# EAGLE design minimal-atmega32u4-arduino (EAGLE 9.5.1)

## Sheet 1 of 2
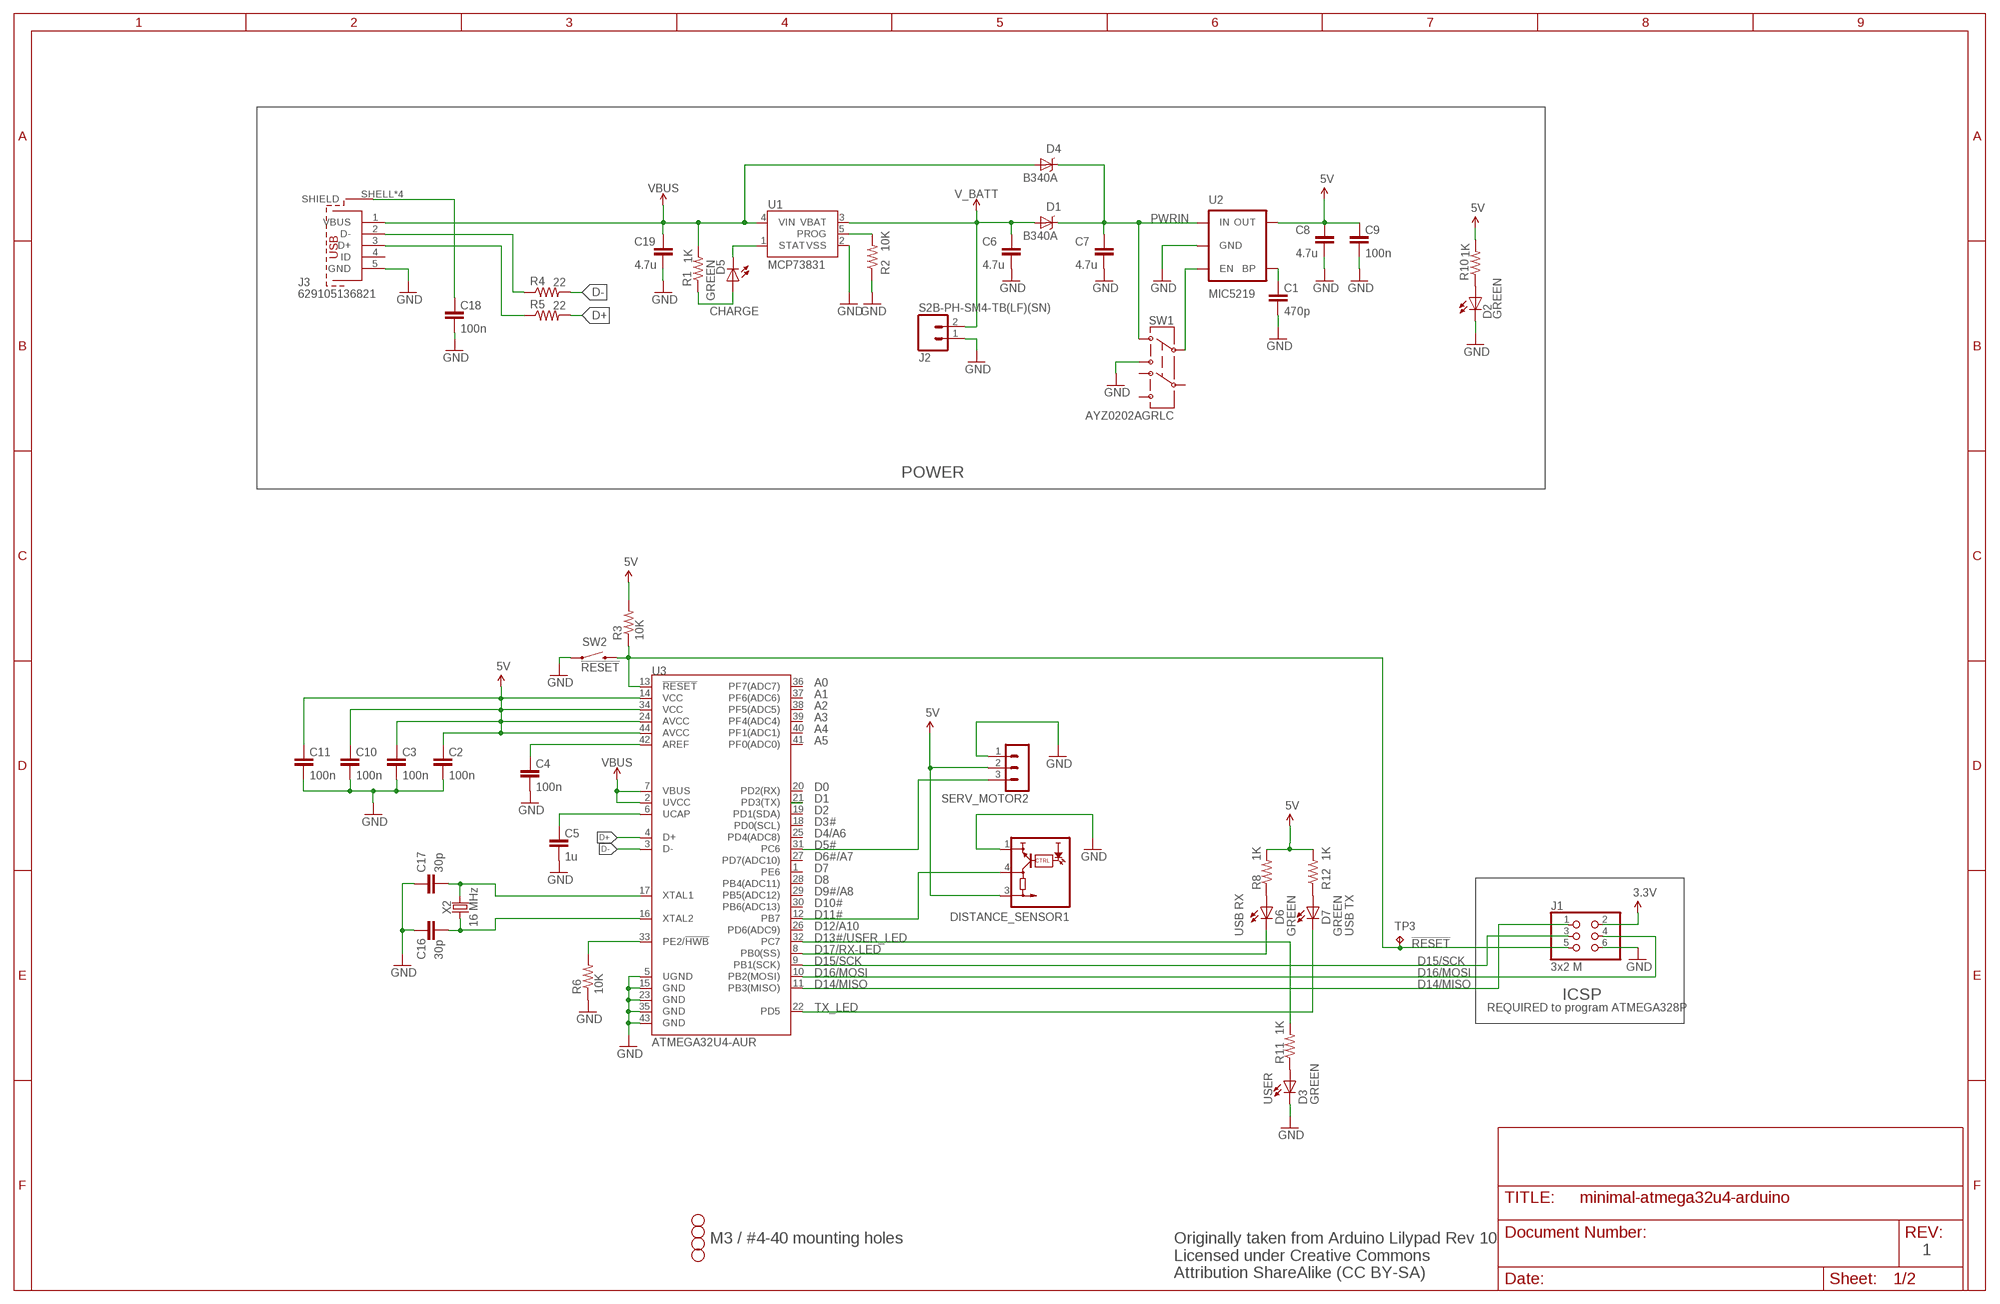
[diagram p0: schematic, sheet 1]

### Parts
C1  470p  C-EUC0805K  [C0805K]
C2  100n  C-EUC0805K  [C0805K]
C3  100n  C-EUC0805K  [C0805K]
C4  100n  C-EUC0805K  [C0805K]
C5  1u  C-EUC0805K  [C0805K]
C6  4.7u  C-EUC0805K  [C0805K]
C7  4.7u  C-EUC0805K  [C0805K]
C8  4.7u  C-EUC0805K  [C0805K]
C9  100n  C-EUC0805K  [C0805K]
C10  100n  C-EUC0805K  [C0805K]
C11  100n  C-EUC0805K  [C0805K]
C16  30p  C-EUC0805K  [C0805K]
C17  30p  C-EUC0805K  [C0805K]
C18  100n  C-EUC0805K  [C0805K]
C19  4.7u  C-EUC0805K  [C0805K]
D1  B340A  DIODE-SCHOTTKY_  [SMA-DIODE]
D2  GREEN  LEDCHIP-LED0805  [CHIP-LED0805]
D3  GREEN  LEDCHIP-LED0805  [CHIP-LED0805]
D4  B340A  DIODE-SCHOTTKY_  [SMA-DIODE]
D5  GREEN  LEDCHIP-LED0805  [CHIP-LED0805]
D6  GREEN  LEDCHIP-LED0805  [CHIP-LED0805]
D7  GREEN  LEDCHIP-LED0805  [CHIP-LED0805]
DISTANCE_SENSOR1  TSSP6P38  [TSSP6P38]
H1  STAND-OFF  [STAND-OFF]
H2  STAND-OFF  [STAND-OFF]
H3  STAND-OFF  [STAND-OFF]
H4  STAND-OFF  [STAND-OFF]
J1  3x2 M  PINHD-2X3  [2X03]
J2  S2B-PH-SM4-TB(LF)(SN)  M02-JST-2MM-SMT  [JST-2-SMD]
J3  629105136821  [629105136821]
R1  1K  R-US_R0805  [R0805]
R2  10K  R-US_R0805  [R0805]
R3  10K  R-US_R0805  [R0805]
R4  22  R-US_R0805  [R0805]
R5  22  R-US_R0805  [R0805]
R6  10K  R-US_R0805  [R0805]
R8  1K  R-US_R0805  [R0805]
R10  1K  R-US_R0805  [R0805]
R11  1K  R-US_R0805  [R0805]
R12  1K  R-US_R0805  [R0805]
SERV_MOTOR2  MA03-1  [MA03-1]
SW1  AYZ0202AGRLC  SWITCH-DPDTSMD  [AYZ0202]
SW2  !RESET  SWITCH-MOMENTARY-2SMD  [TACTILE_SWITCH_SMD]
TP3  TPPAD1-13  [P1-13]
U1  MCP73831  [SOT23-5]
U2  MIC5219  V_REG_MIC5219SMD  [SOT23-5]
U3  ATMEGA32U4-AUR  ATMEGA32U4TQFP-44  [TQFP44]
X2  16 MHz  CRYSTALSMD-HC49UP  [HC49UP]

### Nets
3.3V: C2.1 C3.1 C8.1 C9.1 C10.1 C11.1 J1.2 R3.2 R8.2 R10.2 R12.2 U2.5(OUT) U3.14(VCC) U3.24(AVCC) U3.34(VCC) U3.44(AVCC) ; supply symbol labelled 5V
3.3V3: DISTANCE_SENSOR1.3(VS) SERV_MOTOR2.2 ; supply symbol labelled 5V
!RESET: J1.5 R3.1 SW2.3 TP3.TP U3.13(!RESET)
AREF: C4.1 U3.42(AREF)
D13#/USER_LED: R11.2 U3.32(PC7)
D14/MISO: J1.1 U3.11(PB3(MISO))
D15/SCK: J1.3 U3.9(PB1(SCK))
D16/MOSI: J1.4 U3.10(PB2(MOSI))
D17/RX-LED: D6.C U3.8(PB0(SS))
D+: R5.2 U3.4(D+)
D-: R4.2 U3.3(D-)
GND: C1.2 C2.2 C3.2 C4.2 C5.2 C6.2 C7.2 C8.2 C9.2 C10.2 C11.2 C16.2 C17.2 C18.2 C19.2 D2.C D3.C DISTANCE_SENSOR1.1(GND) J1.6 J2.1 J3.5(GND) R2.1 R6.1 SERV_MOTOR2.1 SW1.3 SW2.1 U1.2(VSS) U2.2(GND) U3.5(UGND) U3.15(GND) U3.23(GND) U3.35(GND) U3.43(GND)
GND1: SERV_MOTOR2.3 U3.31(PC6)
MCPPROG: R2.2 U1.5(PROG)
MIC-BP: C1.1 U2.4(BP)
MIC-EN: SW1.2 U2.3(EN)
N$1: DISTANCE_SENSOR1.4(OUT) U3.12(PB7)
N$3: D5.A R1.1
N$4: D5.C U1.1(STAT)
N$5: U3.21(PD3(TX))
N$7: D2.A R10.1
N$13: D3.A R11.1
N$14: C18.1 J3.SHELL1(SHIELD) J3.SHELL2(SHIELD) J3.SHELL3(SHIELD) J3.SHELL(SHIELD)
N$15: D6.A R8.1
N$16: D7.A R12.1
N$19: J3.2(D-) R4.1
N$20: J3.3(D+) R5.1
PE2/!HWB: R6.2 U3.33(PE2/!HWB)
PWRIN: C7.1 D1.C D4.C SW1.1 U2.1(IN)
TX_LED: D7.C U3.22(PD5)
UCAP: C5.1 U3.6(UCAP)
V_BATT: C6.1 D1.A J2.2 U1.3(VBAT)
VBUS: C19.1 D4.A J3.1(VBUS) R1.2 U1.4(VIN) U3.2(UVCC) U3.7(VBUS)
XTAL1: C17.1 U3.17(XTAL1) X2.2
XTAL2: C16.1 U3.16(XTAL2) X2.1
Unconnected: J3.4(ID) SW1.4 SW1.5 SW1.6 U3.1(PE6) U3.18(PD0(SCL)) U3.19(PD1(SDA)) U3.20(PD2(RX)) U3.25(PD4(ADC8)) U3.26(PD6(ADC9)) U3.27(PD7(ADC10)) U3.28(PB4(ADC11)) U3.29(PB5(ADC12)) U3.30(PB6(ADC13)) U3.36(PF7(ADC7)) U3.37(PF6(ADC6)) U3.38(PF5(ADC5)) U3.39(PF4(ADC4)) U3.40(PF1(ADC1)) U3.41(PF0(ADC0))

### Notes on the sheet
- CHARGE
- POWER
- A0
- A1
- A2
- A3
- A4
- A5
- D0
- D1
- D2
- D3#
- D4/A6
- D5#
- D6#/A7
- D7
- D8
- D9#/A8
- D10#
- D11#
- D12/A10
- USB RX | USB TX
- ICSP
- REQUIRED to program ATMEGA328P
- USER
- M3 / #4-40 mounting holes
- 1
- Originally taken from Arduino Lilypad Rev 10
  Licensed under Creative Commons 
  Attribution ShareAlike (CC BY-SA)

## Sheet 2 of 2

## Library data of the parts
C1 = rcl:C-EU: CAPACITOR, European symbol; DESC: CAP CER 470PF 50V X7R 0805; MFR: Samsung; MPN: CL21B471KBANNNC; SPICEPREFIX: C
C2-C4 C9-C11 C18 = rcl:C-EU: CAPACITOR, European symbol; DESC: CAP CER 0.1UF 50V X7R 0805; MFR: Samsung; MPN: CL21B104KBCNNNC; SPICEPREFIX: C
C5 = rcl:C-EU: CAPACITOR, European symbol; DESC: CAP CER 1UF 16V X7R 0805; MFR: Samsung; MPN: CL21B105KOFNNNG; SPICEPREFIX: C
C6-C8 C19 = rcl:C-EU: CAPACITOR, European symbol; DESC: CAP CER 4.7UF 16V X5R 0805; MFR: Samsung; MPN: CL21A475KOFNNNE; SPICEPREFIX: C
C16 = rcl:C-EU: CAPACITOR, European symbol; DESC: CAP CER 30PF 50V C0G/NP0 0805; MFR: Samsung; MPN: CL21C300JBANNNC; SPICEPREFIX: C
C17 = rcl:C-EU: CAPACITOR, European symbol; DESC: CAP CER 30PF 50V C0G/NP0 0805; MFR: Samsung; MPN: CL21C180JBANNNC; SPICEPREFIX: C
D1 D4 = SparkFun-DiscreteSemi:DIODE-SCHOTTKY: Commonly MBRA140.; DESC: DIODE SCHOTTKY 40V 2A SMA; MFR: Diodes Inc; MPN: B340AE-13
D2 D3 D5-D7 = led:LED: LED OSRAM: - CHIPLED LG R971, LG N971, LY N971, LG Q971, LY Q971, LO R971, LY R971 LH N974, LH R974 LS Q976, LO Q976, LY Q976 LO Q996 - Hyper CHIPLED LW Q18S LB Q993, LB Q99A, LB R99A - SideLED LS A670, LO A670, LY A670, LG A670, LP A670 LB A673, LV A673, LT A673, LW A673 LH A674 LY A675 LS A676, LA A676, LO A676, LY A676, LW A676 LS A679, LY A679, LG A679 - Hyper Micro SIDELED® LS Y876, LA Y876, LO Y876, LY Y876 LT Y87S - SmartLED LW L88C, LW L88S LB L89C, LB L89S, LG L890 LS L89K, LO L89K, LY L89K LS L896, LA L896, LO L896, LY L896 - TOPLED LS T670, LO T670, LY T670, LG T670, LP T670 LSG T670, LSP T670, LSY T670, LOP T670, LYG T670 LG T671, LOG T671, LSG T671 LB T673, LV T673, LT T673, LW T673 LH T674 LS T676, LA T676, LO T676, LY T676, LB T676, LH T676, LSB T676, LW T676 LB T67C, LV T67C, LT T67C, LS T67K, LO T67K, LY T67K, LW E67C LS E67B, LA E67B, LO E67B, LY E67B, LB E67C, LV E67C, LT E67C LW T67C LS T679, LY T679, LG T679 LS T770, LO T770, LY T770, LG T770, LP T770 LB T773, LV T773, LT T773, LW T773 LH T774 LS E675, LA E675, LY E675, LS T675 LS T776, LA T776, LO T776, LY T776, LB T776 LHGB T686 LT T68C, LB T68C - Hyper Mini TOPLED® LB M676 - Mini TOPLED Santana® LG M470 LS M47K, LO M47K, LY M47K Source: http://www.osram.convergy.de LUXEON: - LUMILED® LXK2-PW12-R00, LXK2-PW12-S00, LXK2-PW14-U00, LXK2-PW14-V00 LXK2-PM12-R00, LXK2-PM12-S00, LXK2-PM14-U00 LXK2-PE12-Q00, LXK2-PE12-R00, LXK2-PE12-S00, LXK2-PE14-T00, LXK2-PE14-U00 LXK2-PB12-K00, LXK2-PB12-L00, LXK2-PB12-M00, LXK2-PB14-N00, LXK2-PB14-P00, LXK2-PB14-Q00 LXK2-PR12-L00, LXK2-PR12-M00, LXK2-PR14-Q00, LXK2-PR14-R00 LXK2-PD12-Q00, LXK2-PD12-R00, LXK2-PD12-S00 LXK2-PH12-R00, LXK2-PH12-S00 LXK2-PL12-P00, LXK2-PL12-Q00, LXK2-PL12-R00 Source: www.luxeon.com KINGBRIGHT: KA-3528ASYC Source: www.kingbright.com; DESC: LED GREEN CLEAR 0805 SMD; MFR: Würth Elektronik; MPN: 150080GS75000
DISTANCE_SENSOR1 = opto-vishay:TSSP6P38: IR Mid Range Proximity Sensor Used source: IR Sensor transmitter and receiver diode.pdf Source to corrupt Data sheet <http://www.vishay.com/docs/82475/tssp6p38.pdf>
H1-H4 = SparkFun-Hardware:STAND-OFF: Stand Off Drill holes for mechanically mounting via screws, standoffs, etc. Note: Use the keepout ring to avoid running the screw head into surrounding components. Variant Overviews STAND-OFF - Mechanical footprint for a #4 phillips button head screw. STAND-OFF-TIGHT - Mechanical footprint for a #4 phillips button head screw, Example SparkFun Products Screw - Phillips Head (1/4", 4-40, 10 pack) <https://www.sparkfun.com/products/10453> (PRT-10453) Screw - Phillips Head (1/2", 4-40, 10 pack) <https://www.sparkfun.com/products/10452> (PRT-10452) Screw - Phillips Head (3/4", 4-40, 10 pack) <https://www.sparkfun.com/products/10451> (PRT-10451) Screw - Phillips Head (1", 4-40, 10 pack) <https://www.sparkfun.com/products/10450> (PRT-10450)
J1 = SmartPrj:PINHD-2X3: PIN HEADER; DESC: CONN HEADER VERT 6POS 2ROW 2.54MM; MFR: Harwin; MPN: M20-9980345
J2 = SparkFun-Connectors:M02: Header 2 Standard 2-pin 0.1" header. Use with straight break away headers (SKU : PRT-00116), right angle break away headers (PRT-00553), swiss pins (PRT-00743), machine pins (PRT-00117), and female headers (PRT-00115). Molex polarized connector foot print use with SKU : PRT-08233 with associated crimp pins and housings.; DESC: CONN HEADER SMD R/A 2POS 2MM; MFR: JST; MPN: S2B-PH-SM4-TB(LF)(SN)
J3 = Wurth_Elektronik_Electromechanic_Input-Output_Connectors_rev19b:629105136821: WR-COM SMT Horizontal 5 Contacts Micro USB Type B,5 pins=>Code : Con_I-O_COM_MicroUSB_629105136821 <http://katalog.we-online.de/media/images/eican/Con_I-O_COM_MicroUSB_629105136821_pf2.jpg> Details see: http://katalog.we-online.de/en/em/COM_MICRO_SMT_TYPE_B_HORIZONTAL/629105136821?m Created 2014-07-09, Karrer Zheng 2014 (C) Würth Elektronik; DESC: CONN RCPT USB2.0 MICRO B SMD R/A; MFR: Wurth; MPN: 629105136821
R1 R8 R10-R12 = rcl:R-US_: RESISTOR, American symbol; DESC: RES SMD 1K OHM 1% 1/8W 0805; MFR: Yageo; MPN: RC0805FR-071KL; SPICEPREFIX: R
R2 R3 R6 = rcl:R-US_: RESISTOR, American symbol; DESC: RES SMD 10K OHM 1% 1/8W 0805; MFR: Yageo; MPN: RC0805FR-0710KL; SPICEPREFIX: R
R4 R5 = rcl:R-US_: RESISTOR, American symbol; DESC: RES SMD 22 OHM 1% 1/8W 0805; MFR: Yageo; MPN: RC0805FR-0722RL; SPICEPREFIX: R
SERV_MOTOR2 = con-lstb:MA03-1: PIN HEADER; OC_FARNELL: unknown; OC_NEWARK: unknown
SW1 = SparkFun-Electromechanical:SWITCH-DPDT: DPDT Version of the COM-00597; DESC: SWITCH SLIDE DPDT 100MA 12V; MFR: C&K; MPN: AYZ0202AGRLC
SW2 = SparkFun-Electromechanical:SWITCH-MOMENTARY-2: Various NO switches- pushbuttons, reed, etc; DESC: SWITCH TACTILE SPST-NO 0.05A 12V; MFR: C&K; MPN: RS-187R05A2-DS MT RT
TP3 = testpad:TP: Test pad
U1 = SparkFun-PowerIC:MCP73831: Miniature single cell, fully integrated Li-Ion, Li-polymer charge management controller http://ww1.microchip.com/downloads/en/DeviceDoc/21984a.pdf; DESC: IC CONTROLLR LI-ION 4.2V SOT23-5; MFR: Microchip; MPN: MCP73831T-2ACI/OT; PROD_ID: IC-09995
U2 = SparkFun-PowerIC:V_REG_MIC5219: V_REG MIC5219 Standard 500mA LDO voltage regulator in SOT-23 layout. Micrel part MIC5219. BP (by-pass) pin is used to lower output noise with 470pF cap, may be left open.; DESC: IC REG LINEAR 3.3V 500MA SOT23-5; MFR: Microchip; MPN: MIC5219-3.3YM5-TR
U3 = SparkFun-IC-Microcontroller:ATMEGA32U4: Atmel MCU, 32KByte Atmel 44-pin 8-bit Microcontroller with 32KBytes of ISP Flash and USB Controller Datasheet <http://cdn.sparkfun.com/datasheets/Dev/Arduino/Boards/ATMega32U4.pdf> SparkFun Products LilyPad Arduino USB - ATmega32U4 Board <https://www.sparkfun.com/products/12049> (DEV-12049) Pro Micro - 5V/16MHz <https://www.sparkfun.com/products/12640> (DEV-12640) Pro Micro - 3.3V/8MHz <https://www.sparkfun.com/products/12587> (DEV-12587) Fio v3 - ATmega32U4 <https://www.sparkfun.com/products/11520> (DEV-11520) Qduino Mini <https://www.sparkfun.com/products/13614> (DEV-13614) Makey Makey - Standard Kit <https://www.sparkfun.com/products/11511> (WIG-11511) Makey Makey Deluxe Kit <https://www.sparkfun.com/products/11519> (WIG-11519); DESC: IC MCU 8BIT 32KB FLASH 44TQFP; MFR: Microchip; MPN: ATMEGA32U4-AUR; PROD_ID: IC-10828; VALUE: 32U4
X2 = SparkFun-Clocks:CRYSTAL: Crystals (Generic) These are passive quartz crystals, which can be used as a clock source for a microcontroller. Crystal's are two-terminal devices. They require external "load" capacitors to generate an oscillating signal.; DESC: CRYSTAL 16.000 MHZ 18PF SMD; MFR: ECS; MPN: ECS-160-18-5PX-TR

## Net classes
0 default: width 0.254 mm, clearance 0.254 mm
1 power: width 0.61 mm, drill 0.61 mm, clearance 0.254 mm

## Board
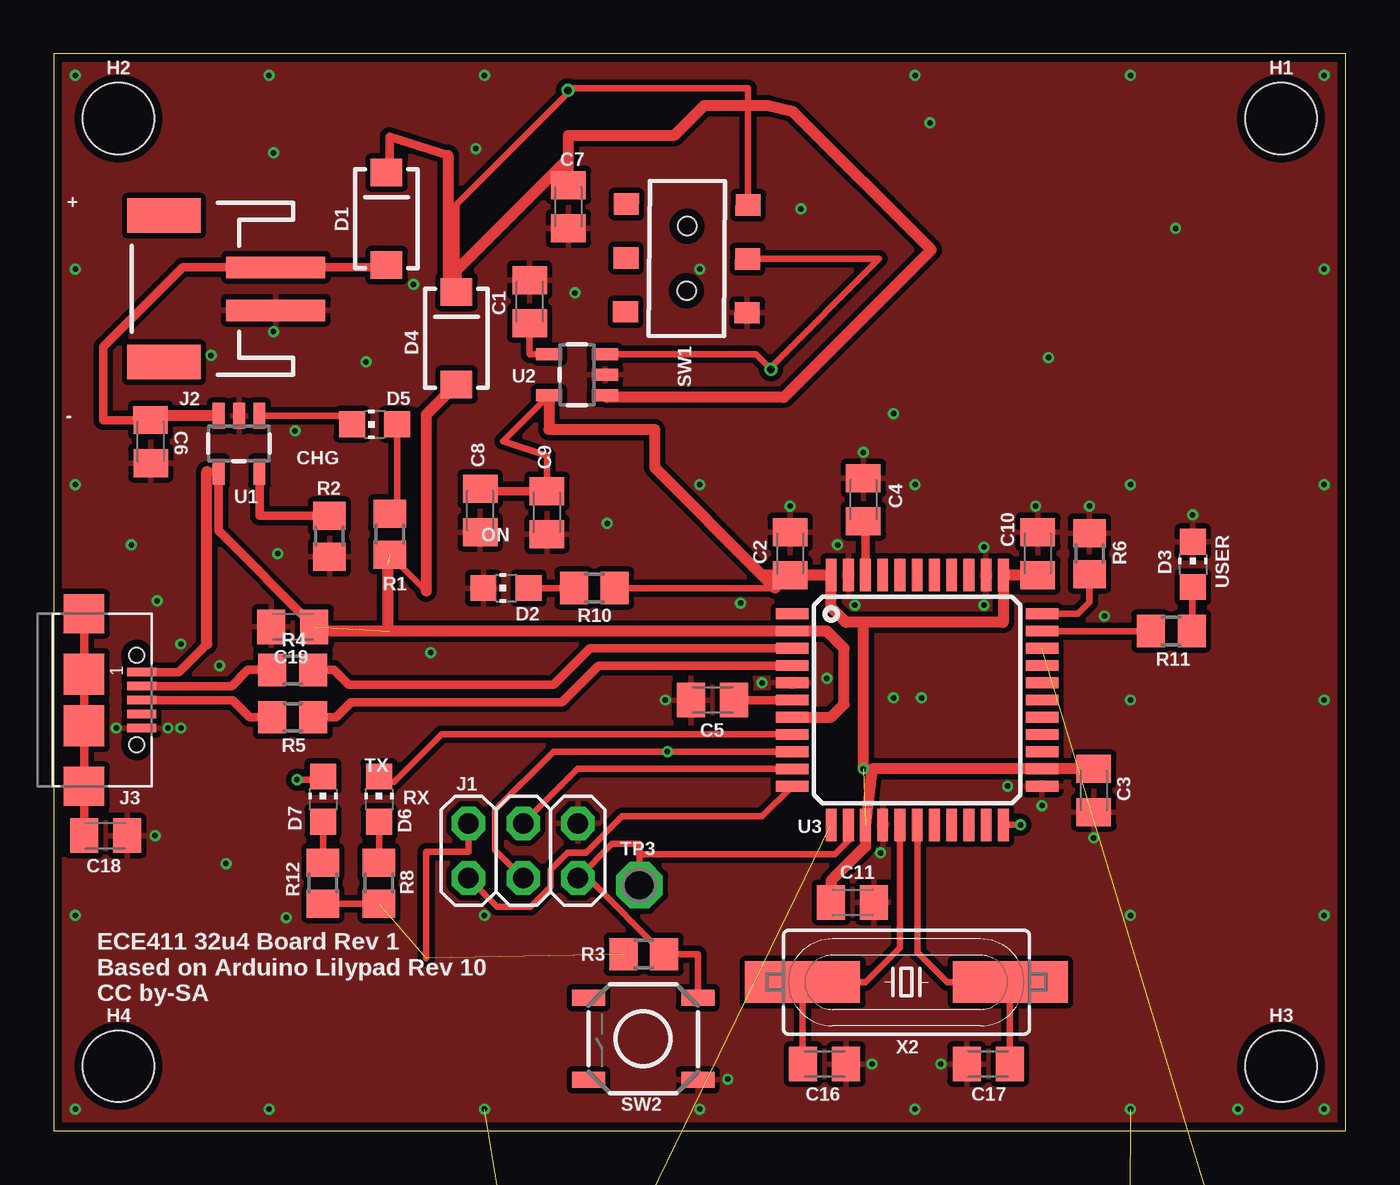
[diagram p1: board, top side]
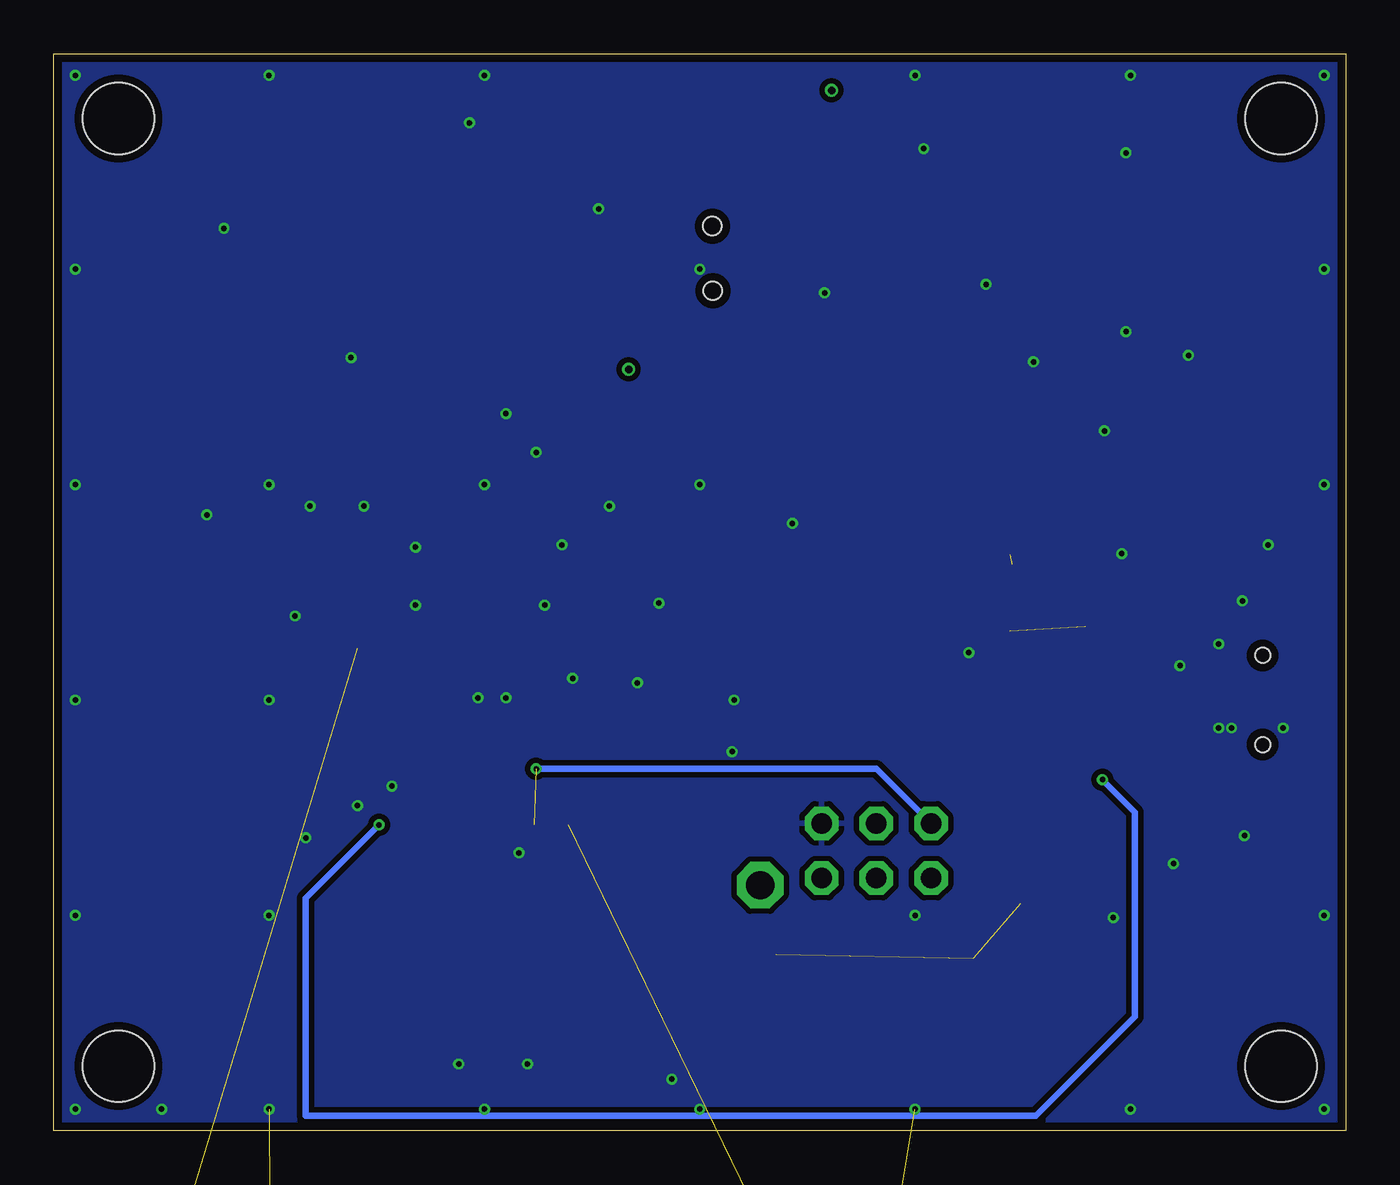
[diagram p2: board, bottom side, seen from below]

Size 60 x 50 mm. Coordinates in mm from the lower left corner, seen from the top.
Outline: 0,0 60,0 60,50 0,50 0,0
Copper layers (1*16): Top 0.035559375mm / dielectric 1.6mm / Bottom 0.035559375mm
Design rules "oshpark-2layer": minimum track width 6mil, minimum drill 10mil, track to track 6mil, track to pad 6mil, pad to pad 6mil, via to via 6mil, smd to smd 6mil, copper to edge 15mil, drill to drill 6mil, minimum pad ring 5mil, minimum via ring 5mil, stop-mask expansion 2.5mil, vias tented up to drill 0mil, thermal gap 10mil

### Footprints (pad centres in the part's own frame; a part is rotated, then mirrored left to right if it is on the bottom)
C0805K = smd 1.3 x 1.6: 1 -1,0; 2 1,0
SMA-DIODE = smd 1.27 x 1.47: A -2.15,0; C 2.15,0
CHIP-LED0805 = smd 1.2 x 1.2: A 0,-1.05; C 0,1.05
TSSP6P38 = smd 0.9 x 2.2: 1 -1.905,-1.905; 2 -0.635,-1.905; 3 0.635,-1.905; 4 1.905,-1.905
STAND-OFF = hole 3.302: 0,0
2X03 = drill 0.95 pad 1.55 octagon: 1 -2.54,-1.27; 2 -2.54,1.27; 3 0,-1.27; 4 0,1.27; 5 2.54,-1.27; 6 2.54,1.27
JST-2-SMD = smd 1 x 4.6: 1 -1,-3.7; 2 1,-3.7 | smd 1.6 x 3.4: NC1 -3.4,1.5; NC2 3.4,1.5
629105136821 = smd 0.4 x 1.35: 1 -1.3,2.675; 2 -0.65,2.675; 3 0,2.675; 4 0.65,2.675; 5 1.3,2.675 | smd 1.8 x 1.9: SHELL -4,0; SHELL3 4,0 | smd 1.9 x 1.9: SHELL1 -1.2,0; SHELL2 1.2,0 | hole 0.7: -2.075,2.45; 2.075,2.45
R0805 = smd 1.3 x 1.5: 1 -0.95,0; 2 0.95,0
MA03-1 = drill 1.016 long: 1 -2.54,0; 2 0,0; 3 2.54,0
AYZ0202 = smd 1 x 1.15: 1 -2.5,2.825; 2 0,2.825; 3 2.5,2.825; 4 -2.5,-2.825; 5 0,-2.825; 6 2.5,-2.825 | hole 0.85: 1.5,0; -1.5,0
TACTILE_SWITCH_SMD = smd 1.524 x 0.762: 1 -2.54,1.905; 2 2.54,1.905; 3 -2.54,-1.905; 4 2.54,-1.905
P1-13 = drill 1.321 pad 2.159 octagon: TP 0,0
SOT23-5 = smd 0.55 x 1.2: 1 -0.95,-1.3; 2 0,-1.3; 3 0.95,-1.3; 4 0.95,1.3; 5 -0.95,1.3
TQFP44 = smd 1.5 x 0.5: 1 -5.8,4; 2 -5.8,3.2; 3 -5.8,2.4; 4 -5.8,1.6; 5 -5.8,0.8; 6 -5.8,0; 7 -5.8,-0.8; 8 -5.8,-1.6; 9 -5.8,-2.4; 10 -5.8,-3.2; 11 -5.8,-4; 23 5.8,-4; 24 5.8,-3.2; 25 5.8,-2.4; 26 5.8,-1.6; 27 5.8,-0.8; 28 5.8,0; 29 5.8,0.8; 30 5.8,1.6; 31 5.8,2.4; 32 5.8,3.2; 33 5.8,4 | smd 0.5 x 1.5: 12 -4,-5.8; 13 -3.2,-5.8; 14 -2.4,-5.8; 15 -1.6,-5.8; 16 -0.8,-5.8; 17 0,-5.8; 18 0.8,-5.8; 19 1.6,-5.8; 20 2.4,-5.8; 21 3.2,-5.8; 22 4,-5.8; 34 4,5.8; 35 3.2,5.8; 36 2.4,5.8; 37 1.6,5.8; 38 0.8,5.8; 39 0,5.8; 40 -0.8,5.8; 41 -1.6,5.8; 42 -2.4,5.8; 43 -3.2,5.8; 44 -4,5.8
HC49UP = smd 5.334 x 1.93: 1 -4.826,0; 2 4.826,0

### Placement (x,y rotation side)
C1  22.1,38.5 90 top
C2  34.2,26.8 90 top
C3  48.3,15.8 270 top
C4  37.6,29.3 90 top
C5  30.6,20 180 top
C6  4.5,32 270.2 top
C7  23.9,42.9 270 top
C8  19.8,28.8 270 top
C9  22.9,28.7 270 top
C10  45.7,26.8 90 top
C11  37.1,10.6 0 top
C16  35.8,3.1 0 top
C17  43.4,3.1 180 top
C18  2.4,13.7 0 top
C19  11.1,23.4 180 top
D1  15.45,42.34 90 top
D2  21,25.2 90 top
D3  52.9,26.3 0 top
D4  18.7,36.8 90 top
D5  14.9,32.8 90 top
D6  15.1,15.4 0 top
D7  12.5,15.4 0 top
DISTANCE_SENSOR1  23.4,-6.1 0 top  (outside the outline)
H1  57,47 0 top
H2  3,47 0 top
H3  57,3 0 top
H4  3,3 0 top
J1  21.8,13 0 top
J2  6.61,39.09 90 top
J3  1.4,20 270 top
R1  15.6,27.7 270 top
R2  12.8,27.6 90 top
R3  27.4,8.2 180 top
R4  11.1,21.4 0 top
R5  11.1,19.2 0 top
R6  48.1,26.8 270 top
R8  15.1,11.5 270 top
R10  25.1,25.2 0 top
R11  51.9,23.2 180 top
R12  12.5,11.5 270 top
SERV_MOTOR2  52.5,-7.8 0 top  (outside the outline)
SW1  29.4,40.5 269.5 top
SW2  27.37,4.27 180 top
TP3  27.2,11.4 0 top
U1  8.6,31.9 180 top
U2  24.3,35.1 90 top
U3  40.1,20 0 top
X2  39.6,6.9 0 top

### Tracks (layer width: path | path; a pad name or v marks a point on that pad's centre or on a via)
3.3V  (via drill 0.25)  (3 unrouted)
  Top 0.3: J1.2 19.26,12.95 17.3,12.95 17.3,8 | U2.5 20.87,32.02 22.9,31.33 C9.1 | R10.2 33.5,25.2 | R12.2 R8.2
  Top 0.4: C8.1 19.8,29.7 C9.1
  Top 0.5: C11.1 36.1,11.6 37.7,13.2 U3.14 38,16.8 U3.24 C3.1 | C10.1 U3.34 44.1,23.6 37.6,23.6 | 37.6,23.6 36.8,23.6 36.1,24.3 U3.44 C2.1 32.9,25.8 | 32.9,25.8 27.9,30.8 27.9,32.55 23,32.55 U2.5 | v37.6,16.8 37.6,23.6 | 32.9,25.8 33.5,25.2
  Bottom 0.3: J1.2 21.79,16.8 v37.6,16.8
3.3V3  (1 unrouted)
!RESET
  Top 0.3: U3.13 36.9,13.45 36.27,12.83 27.2,12.83 | SW2.3 29.91,8.2 R3.1 24.85,11.7 24.31,11.7 J1.5 25.94,13.33 27.2,13.33 27.2,12.83 | TP3.TP 27.2,12.83
AREF
  Top 0.4: C4.1 37.7,28.2 U3.42
D13#/USER_LED
  Top 0.3: R11.2 U3.32
D14/MISO
  Top 0.3: U3.11 32.9,14.6 26.4,14.6 24.71,12.91 23.85,12.91 23.06,12.12 23.06,11.32 22.14,10.4 20.59,10.4 J1.1
D15/SCK
  Top 0.3: U3.9 23.2,17.6 20.5,14.9 20.5,13.03 J1.3
D16/MOSI
  Top 0.3: U3.10 24.33,16.8 J1.4
D17/RX-LED
  Top 0.3: U3.8 18,18.4 15.8,16.2 15.35,16.2 D6.C
D+
  Top 0.4: U3.4 25.3,21.6 23.6,19.9 13.8,19.9 13.1,19.2 R5.2
D-
  Top 0.4: R4.2 13,21.4 13.7,20.7 23.2,20.7 24.9,22.4 U3.3
GND  (via drill 0.25)  (2 unrouted)
  other vias: 40.3,20.1 17.5,22.2 35.9,21 32.9,20.8 39,20.1 44.3,16 45.9,15.1 43.2,27.1 43.2,24.4 37.2,24.4 36.4,27.2 10.4,26.8 5.3,18.7 2.9,18.7 5.9,18.7 7.7,21.6 5.9,22.6 4.8,24.6 3.6,27.2 11.2,32.5 10.2,37.1 7.3,36 16.7,39.3 39,33.3 24.2,38.9 46.2,35.9 14.5,35.7 19.6,45.6 25.7,28.2 28.4,20 31.3,2.4 38,3.1 41.2,3.1 38.4,12.9 48.3,13.6 52.9,28.6 48.1,29 45.6,29 37.6,31.5 34.2,29 4.7,13.7 1,49 59,49 59,1 1,1 1,10 1,30 10,49 20,49 40.7,46.8 40,49 50,49 59,40 59,30 59,20 59,10 55,1 50,1 40,1 30,1 20,1 10,1 28.5,17.6 8,12.4 31.9,24.5 30,40 52.1,41.9 48.8,23.9 50,10 50,20 10.8,9.9 20,10 34.7,42.8 50,30 40,30 30,30 10.2,45.4 1,40
  pour Top: 0,0 60,0 60,50 0,50
  pour Bottom: -1.8,-1.9 62,-1.9 62,51.5 -1.8,51.5
GND1  (1 unrouted)
MCPPROG
  Top 0.4: U1.5 9.55,28.55 R2.2
MIC-BP
  Top 0.3: C1.1 22.1,36.05 U2.4
MIC-EN  (via drill 0.35)
  Top 0.3: SW1.2 38.33,40.48 33.3,35.45 v33.3,35.35 32.6,36.05 U2.3
N$1  (1 unrouted)
N$3
  Top 0.3: R1.1 15.95,29 D5.A
N$4
  Top 0.3: D5.C 13.45,33.2 U1.1
N$7
  Top 0.3: D2.A R10.1
N$13
  Top 0.3: R11.1 D3.A
N$14
  Top 0.4: C18.1 J3.SHELL3 J3.SHELL2 J3.SHELL1 J3.SHELL
N$15
  Top 0.3: D6.A R8.1
N$16
  Top 0.3: D7.A 12.5,13.05 12.55,13 12.5,12.95 R12.1
N$19
  Top 0.4: J3.2 8.25,20.65 9,21.4 R4.1
N$20
  Top 0.4: J3.3 8.3,20 9.1,19.2 R5.1
PE2/!HWB
  Top 0.3: U3.33 47.55,24 48.1,24.55 R6.2
PWRIN  (via drill 0.35)
  Top 0.3: D4.C 18.7,43.02 23.88,48.2 v23.88,48.3 23.98,48.4 32.25,48.4 SW1.1
  Top 0.4: D1.C 15.59,44.63 15.59,46.14 18.3,45.28
  Top 0.5: 18.3,45.28 18.3,39.35 D4.C 18.7,39.95 23.9,45.15 C7.1 23.9,46.2 28.8,46.2 30.2,47.6 33.16,47.6 34.33,47.32 40.75,40.9 33.9,34.05 25.7,34.05 U2.1
TX_LED  (via drill 0.25)
  Top 0.3: v44.9,14.2 U3.22 | v11.3,16.3 12.35,16.3 D7.C
  Bottom 0.3: v44.9,14.2 48.3,10.8 48.3,0.7 14.4,0.7 9.8,5.3 9.8,14.8 v11.3,16.3
UCAP
  Top 0.4: U3.6 C5.1
V_BATT
  Top 0.4: C6.1 2.29,33 2.3,33.01 2.3,36.4 5.99,40.09 J2.2 15.39,40.09 D1.A
  Top 0.5: U1.3 4.54,33.2 C6.1
VBUS  (2 unrouted)
  Top 0.3: R1.2 17.3,25.05
  Top 0.4: J3.1 5.8,21.3 7.1,22.6 | C19.1 7.65,27.85 U1.4 7.1,30.6 | 15.5,23.3 15.6,23.2
  Top 0.5: U3.7 36.1,19.2 36.7,19.8 36.7,22.4 35.9,23.2 U3.2 12.3,23.2 C19.1 | 7.1,22.6 7.1,30.6 | D4.A 17.3,33.25 17.3,25.05 | 15.5,26.3 15.5,23.3
XTAL1
  Top 0.3: U3.17 40.1,8.3 41.5,6.9 X2.2 44.4,6.87 C17.1
XTAL2
  Top 0.3: U3.16 39.3,8.5 37.7,6.9 X2.1 34.77,3.13 C16.1

### Text on the board
tPlace: + | - | CHG | ON | USER | TX | RX | ECE411 32u4 Board Rev 1 / Based on Arduino Lilypad Rev 10 / CC by-SA